# EAGLE design FTDI breakout-v1.0 (EAGLE 6.2)
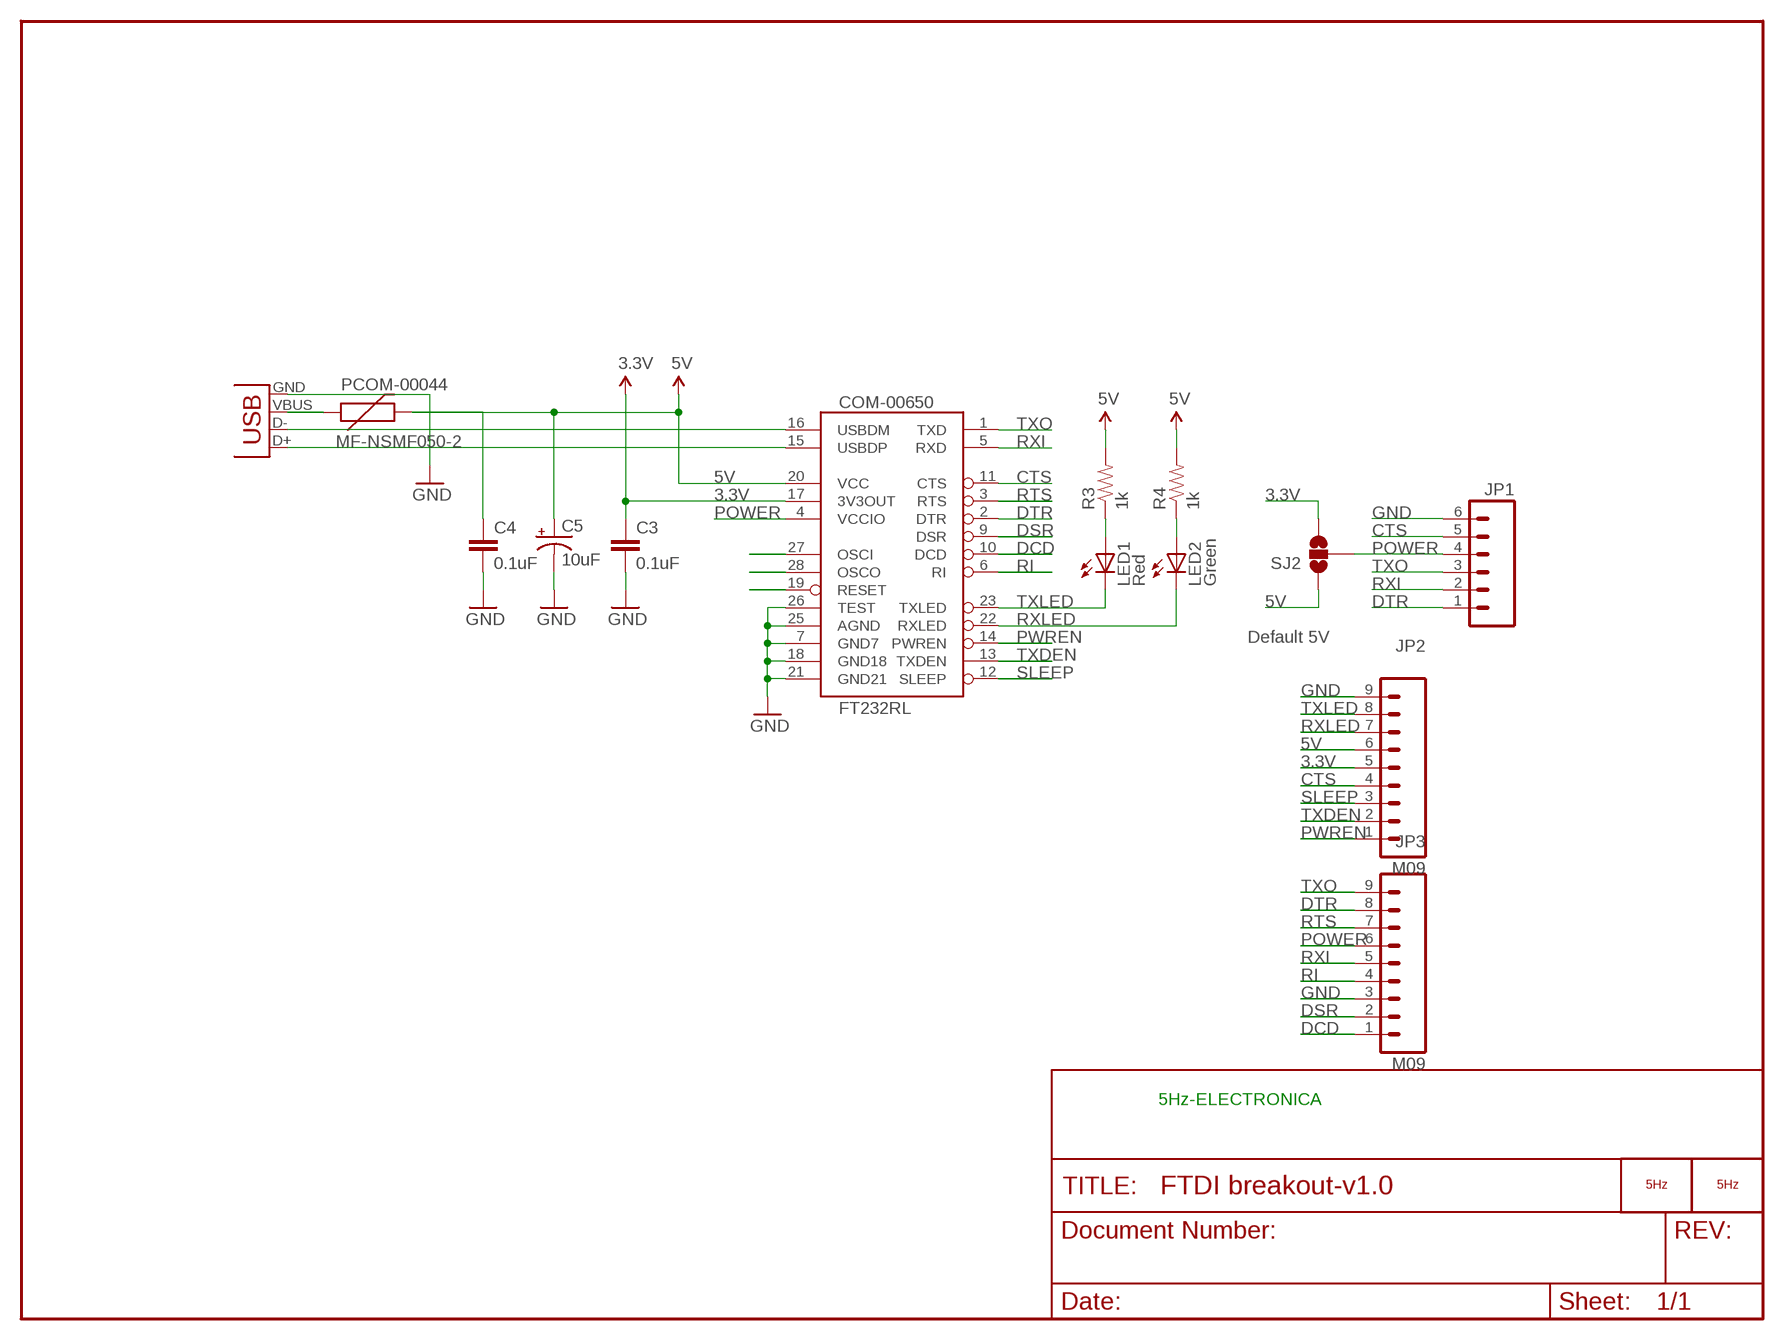
[diagram p0: schematic, sheet 1]

## Parts
C3  0.1uF  CAP0603-CAP  [0603-CAP]
C4  0.1uF  CAP0603-CAP  [0603-CAP]
C5  10uF  CAP_POL1206  [EIA3216]
COM-00650  FT232RL  FT232RLSSOP  [SSOP28DB]
JP1  M06SIP  [1X06]
JP2  M09  [1X09]
JP3  M09  [1X09]
LED1  Red  LED0603  [LED-0603]
LED2  Green  LED0603  [LED-0603]
LOGO1  LOGO_5HZ_H_5MM  [5HZ_LOGO_H_5MM]
LOGO2  LOGO_5HZ_H_15MM  [5HZ_LOGO_H_15MM]
PCOM-00044  MF-NSMF050-2  PTCSMD  [PTC-1206]
PRT-00587  897-43-005-00-100001  USBSMD  [USB-MINIB]
R3  1k  RESISTOR0603-RES  [0603-RES]
R4  1k  RESISTOR0603-RES  [0603-RES]
SJ2  SOLDERJUMPER_2WAYS  [SJ_3]

## Nets
3.3V [power]: C3.1 COM-00650.17(3V3OUT) JP2.5 SJ2.3
5V: C4.1 C5.A(+) COM-00650.20(VCC) JP2.6 PCOM-00044.2 R3.2 R4.2 SJ2.1
CTS: COM-00650.11(CTS) JP1.5 JP2.4
DCD: COM-00650.10(DCD) JP3.1
DSR: COM-00650.9(DSR) JP3.2
DTR: COM-00650.2(DTR) JP1.1 JP3.8
GND [power]: C3.2 C4.2 C5.C(-) COM-00650.7(GND7) COM-00650.18(GND18) COM-00650.21(GND21) COM-00650.25(AGND) COM-00650.26(TEST) JP1.6 JP2.9 JP3.3 PRT-00587.GND
N$1: LED1.A R3.1
N$2: LED2.A R4.1
N$3: PCOM-00044.1 PRT-00587.VBUS
N$11: COM-00650.19(RESET)
N$12: COM-00650.28(OSCO)
N$13: COM-00650.27(OSCI)
POWER: COM-00650.4(VCCIO) JP1.4 JP3.6 SJ2.2
PWREN: COM-00650.14(PWREN) JP2.1
RI [power]: COM-00650.6(RI) JP3.4
RTS: COM-00650.3(RTS) JP3.7
RXI: COM-00650.5(RXD) JP1.2 JP3.5
RXLED: COM-00650.22(RXLED) JP2.7 LED2.C
SLEEP: COM-00650.12(SLEEP) JP2.3
TXDEN: COM-00650.13(TXDEN) JP2.2
TXLED: COM-00650.23(TXLED) JP2.8 LED1.C
TXO: COM-00650.1(TXD) JP1.3 JP3.9
USB_D+: COM-00650.15(USBDP) PRT-00587.D+
USB_D-: COM-00650.16(USBDM) PRT-00587.D-

## Notes on the sheet
- Default 5V
- 5Hz-ELECTRONICA

## Library data of the parts
C3 C4 = SparkFun:CAP: Capacitor Standard 0603 ceramic capacitor, and 0.1" leaded capacitor.
C5 = SparkFun:CAP_POL: Capacitor Polarized These are standard SMD and PTH capacitors. Normally 10uF, 47uF, and 100uF in electrolytic and tantalum varieties. Always verify the external diameter of the through hole cap, it varies with capacity, voltage, and manufacturer. The EIA devices should be standard.
COM-00650 = SparkFun:FT232RL: USB UART FT232RL 4th Generation USB UART (USB <-> Serial) Controller. Spark Fun Electronics SKU : COM-00650
JP1 = SparkFun:M06: Header 6 Standard 6-pin 0.1" header. Use with straight break away headers (SKU : PRT-00116), right angle break away headers (PRT-00553), swiss pins (PRT-00743), machine pins (PRT-00117), and female headers (PRT-00115). Molex polarized connector foot print use with SKU : PRT-08094 with associated crimp pins and housings. NOTES ON THE VARIANTS LOCK and LOCK_LONGPADS... This footprint was designed to help hold the alignment of a through-hole component (i.e. 6-pin header) while soldering it into place. You may notice that each hole has been shifted either up or down by 0.005 of an inch from it's more standard position (which is a perfectly straight line). This slight alteration caused the pins (the squares in the middle) to touch the edges of the holes. Because they are alternating, it causes a "brace" to hold the component in place. 0.005 has proven to be the perfect amount of "off-center" position when using our standard breakaway headers. Although looks a little odd when you look at the bare footprint, once you have a header in there, the alteration is very hard to notice. Also, if you push a header all the way into place, it is covered up entirely on the bottom side. This idea of altering the position of holes to aid alignment will be further integrated into the Sparkfun Library for other footprints. It can help hold any component with 3 or more connection pins.
JP2 JP3 = SparkFun:M09: Header 9 Standard 9-pin 0.1" header. Use with straight break away headers (SKU : PRT-00116), right angle break away headers (PRT-00553), swiss pins (PRT-00743), machine pins (PRT-00117), and female headers (PRT-00115).
LED1 LED2 = SparkFun:LED: LEDs Standard schematic elements and footprints for 5mm, 3mm, 1206, and 0603 sized LEDs. 5mm - Spark Fun Electronics SKU : COM-00529 (and others)
LOGO1 LOGO2 = 5hz-electronica:LOGO_5HZ: Logotipo 5Hz "según Pedro"
PCOM-00044 = SparkFun:PTC: Resettable Fuse PTC Resettable Fuse. Spark Fun Electronics SKU : COM-08357
PRT-00587 = SparkFun:USB: USB Connectors USB-B-PTH is fully proven SKU : PRT-00139 USB-miniB is fully proven SKU : PRT-00587 USB-A-PCB is untested. USB-A-H is throughly reviewed, but untested. Spark Fun Electronics SKU : PRT-00437 USB-B-SMT is throughly reviewed, but untested. Needs silkscreen touching up. USB-A-S has not been used/tested USB-MB-H has not been used/tested
R3 R4 = SparkFun:RESISTOR: Resistor Basic schematic elements and footprints for 0603, 1206, and PTH resistors.
SJ2 = SparkFun:SOLDERJUMPER_2WAY: Solder Jumper 2 way solder jumper

## Net classes
0 default: width 0.203 mm
1 power: width 0.254 mm

## Board
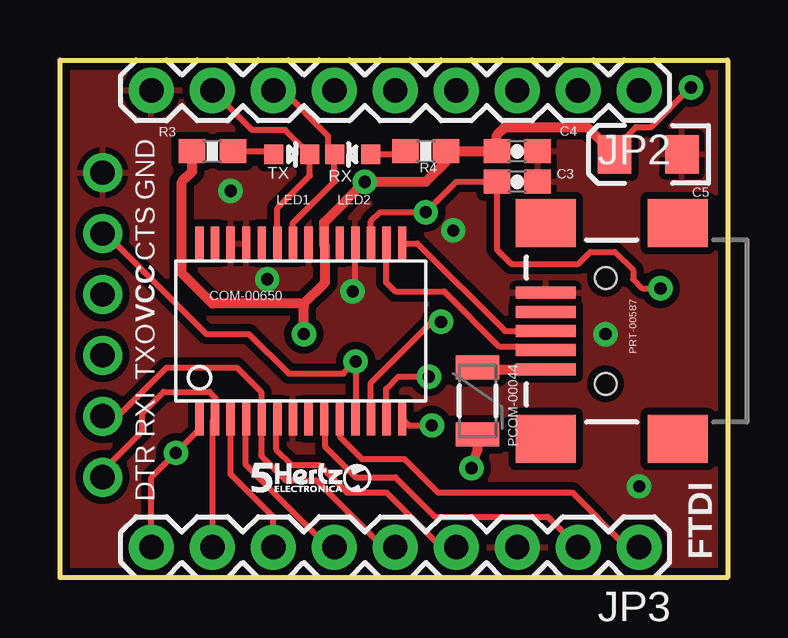
[diagram p1: board, top side]
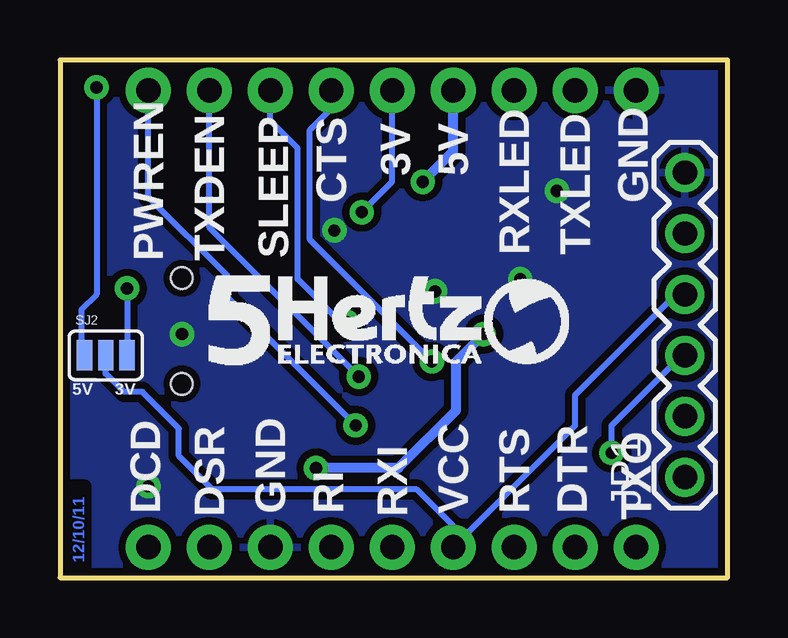
[diagram p2: board, bottom side, seen from below]

Size 27.81 x 21.59 mm. Coordinates in mm from the lower left corner, seen from the top.
Outline: 0,21.59 27.81,21.59 27.81,0 0,0 0,21.59
Copper layers (1*16): Top 0.035mm / dielectric 1.5mm / Bottom 0.035mm
Design rules: minimum track width 8mil, minimum drill 20mil, track to track 8mil, track to pad 8mil, pad to pad 8mil, via to via 8mil, smd to smd 8mil, copper to edge 10mil, drill to drill 8mil, minimum pad ring 12mil, minimum via ring 10mil, stop-mask expansion 4mil, vias tented up to drill 25mil, thermal gap 10mil

### Footprints (pad centres in the part's own frame; a part is rotated, then mirrored left to right if it is on the bottom)
0603-CAP = smd 1.1 x 1: 1 -0.85,0; 2 0.85,0
EIA3216 = smd 1.4 x 1.6: A 1.4,0; C -1.4,0
SSOP28DB = smd 0.348 x 1.397: 1 -4.225,-3.656; 2 -3.575,-3.656; 3 -2.925,-3.656; 4 -2.275,-3.656; 5 -1.625,-3.656; 6 -0.975,-3.656; 7 -0.325,-3.656; 8 0.325,-3.656; 9 0.975,-3.656; 10 1.625,-3.656; 11 2.275,-3.656; 12 2.925,-3.656; 13 3.575,-3.656; 14 4.225,-3.656; 15 4.225,3.656; 16 3.575,3.656; 17 2.925,3.656; 18 2.275,3.656; 19 1.625,3.656; 20 0.975,3.656; 21 0.325,3.656; 22 -0.325,3.656; 23 -0.975,3.656; 24 -1.625,3.656; 25 -2.275,3.656; 26 -2.925,3.656; 27 -3.575,3.656; 28 -4.225,3.656
1X06 = drill 1.016: 1 0,0; 2 2.54,0; 3 5.08,0; 4 7.62,0; 5 10.16,0; 6 12.7,0
1X09 = drill 1.016 pad 1.88: 1 0,0; 2 2.54,0; 3 5.08,0; 4 7.62,0; 5 10.16,0; 6 12.7,0; 7 15.24,0; 8 17.78,0; 9 20.32,0
LED-0603 = smd 0.8 x 0.8: A 0,-0.75; C 0,0.75
PTC-1206 = smd 1 x 1.8: 1 -1.4,0; 2 1.4,0
USB-MINIB = smd 2.5 x 0.5: D+ 2.5,0; D- 2.5,0.8; GND 2.5,-1.6; ID 2.5,-0.8; VBUS 2.5,1.6 | smd 2.5 x 2: GND@1 -3,-4.5; GND@2 -3,4.5; GND@3 2.5,4.5; GND@4 2.5,-4.5 | hole 0.9: 0,2.2; 0,-2.2
0603-RES = smd 1.1 x 1: 1 -0.85,0; 2 0.85,0
SJ_3 = smd 0.635 x 1.27: 1 -0.889,0; 2 0,0; 3 0.889,0

### Placement (x,y rotation side)
C3  19.05,16.51 0 top
C4  19.05,17.78 0 top
C5  24.51,17.65 180 top
COM-00650  10.03,10.29 0 top
JP1  1.78,4.19 90 bottom
JP2  24.13,20.32 180 top
JP3  24.13,1.27 180 top
LED1  9.65,17.65 270 top
LED2  12.19,17.65 90 top
LOGO1  8,3.56 0 top
LOGO2  21.59,8.89 0 bottom
PCOM-00044  17.4,7.37 270 top
PRT-00587  22.73,10.29 180 top
R3  6.35,17.78 180 top
R4  15.24,17.78 0 top
SJ2  25.91,9.27 0 bottom

### Tracks (layer width: path | path; a pad name or v marks a point on that pad's centre or on a via)
3.3V  (via drill 0.51)
  Top 0.254: COM-00650.17 12.96,14.86 13.34,15.24 v15.24,15.24 16.51,16.51 C3.1 18.2,13.68 18.8,13.08 21.59,13.08 22.1,13.59 23.11,13.59 23.88,12.83 23.88,12.45 24.26,12.06 v25.02,12.06
  Bottom 0.254: JP2.5 13.97,16.51 v15.24,15.24 | v25.02,12.06 SJ2.3
5V  (via drill 0.51)
  Top 0.254: 16.09,17.36 R4.2 | 10.03,11.43 10.16,11.43 | C5.A 23.11,17.9 24,18.8 24.64,18.8 v26.29,20.45
  Top 0.305: 11.01,13.88 COM-00650.20
  Top 0.406: 11.01,13.88 11.05,13.84 11.05,12.32 10.16,11.43 | 16.09,17.36 15.24,16.51 v12.7,16.51 11.01,14.82 COM-00650.20 | R3.2 5.5,16.93 5.08,16.51 5.08,12.7 6.35,11.43 10.03,11.43 10.16,11.3 v10.16,10.16 | C5.A 21.97,18.8 18.54,18.8 18.2,18.45 C4.1 R4.2 | PCOM-00044.2 17.4,5.33 v17.14,4.57
  Bottom 0.254: v26.29,20.45 26.29,11.81 26.92,11.18 26.92,9.4 SJ2.1
  Bottom 0.406: JP2.6 11.43,17.78 v12.7,16.51 | v17.14,4.57 13.72,4.57 11.3,6.99 11.3,9.02 v10.16,10.16
CTS  (via drill 0.51)
  Top 0.254: COM-00650.11 12.32,6.64 v12.32,9.02 11.81,8.51 9.53,8.51 7.87,10.16 6.1,10.16 1.91,14.35 JP1.5
  Bottom 0.254: JP2.4 16.51,19.56 17.4,18.67 17.4,14.1 v12.32,9.02
DCD
  Top 0.254: JP3.1 23.62,1.27 21.34,3.56 15.75,3.56 14.35,4.95 12.57,4.95 11.68,5.84 11.68,6.61 COM-00650.10
DSR
  Top 0.254: JP3.2 20.32,2.54 15.62,2.54 13.97,4.19 12.32,4.19 11.05,5.46 11.05,6.59 COM-00650.9
DTR
  Top 0.254: JP1.1 1.78,4.45 3.43,6.1 3.43,6.86 4.32,7.75 6.22,7.75 6.48,7.49 6.48,6.6 COM-00650.2 6.35,6.52 JP3.8
GND  (via drill 0.51)
  Top 0.254: 12.31,12.05 COM-00650.18
  other vias: 7.11,16.13 24.13,3.81 8.64,12.45 12.19,11.94 22.73,10.16 16.38,14.48
  pour Top (isolate 0.305): 0,21.59 27.81,21.59 27.81,0 0.13,0
  pour Bottom (isolate 0.305): 0,21.59 27.81,21.59 27.81,0 24.51,0 3.17,0.13 -0.13,0.13
N$1
  Top 0.254: R3.1 8.78,17.78 LED1.A
N$2
  Top 0.254: LED2.A 14.26,17.65 R4.1
N$3
  Top 0.254: PCOM-00044.1 17.61,8.69
  Top 0.406: 17.61,8.69 PRT-00587.VBUS
POWER
  Top 0.254: JP3.6 11.18,1.27 7.75,4.7 7.75,6.62 COM-00650.4
  Bottom 0.254: JP1.4 2.16,11.81 6.35,7.62 6.35,6.35 JP3.6 11.43,2.16 12.95,3.68 21.46,3.68 22.86,5.08 22.86,6.22 24.38,7.75 25.15,7.75 25.91,8.51 SJ2.2
PWREN  (via drill 0.51)
  Top 0.254: v15.49,6.35 14.54,6.35 COM-00650.14
  Bottom 0.254: JP2.1 24.13,15.88 20.83,12.57 20.83,11.68 v15.49,6.35
RI
  Top 0.254: JP3.4 15.88,1.27 13.59,3.56 11.94,3.56 10.79,4.7 9.65,4.7 9.02,5.33 9.02,6.59 COM-00650.6
RTS
  Top 0.254: JP3.7 8.89,2.54 7.11,4.32 COM-00650.3
RXI
  Top 0.254: JP1.2 2.41,6.73 4.45,8.76 7.37,8.76 8.38,7.75 8.38,6.66 COM-00650.5 | 8.38,6.6 COM-00650.5 | JP3.5 13.46,1.27 10.67,4.06 9.4,4.06 8.38,5.08 8.38,6.61 COM-00650.5
RXLED
  Top 0.254: COM-00650.22 9.71,14.79 11.43,16.51 LED2.C 11.18,17.92 11.18,18.41 9.27,20.32 JP2.7
SLEEP  (via drill 0.51)
  Top 0.254: v15.88,10.67 15.49,10.67 12.95,8.13 COM-00650.12
  Bottom 0.254: JP2.3 19.05,19.05 17.91,17.91 17.91,12.45 16.13,10.67 v15.88,10.67
TXDEN  (via drill 0.51)
  Top 0.254: v15.37,8.38 14.1,8.38 13.59,7.87 13.59,6.65 COM-00650.13
  Bottom 0.254: JP2.2 21.59,14.61 v15.37,8.38
TXLED
  Top 0.254: COM-00650.23 9.06,15.41 10.41,16.76 10.41,17.64 LED1.C 9.39,18.67 8,18.67 JP2.8
TXO  (via drill 0.51)
  Top 0.254: COM-00650.1 5.81,6.19 v4.83,5.21 3.81,4.19 JP3.9
  Bottom 0.254: v4.83,5.21 4.83,6.35 1.91,9.27
  Bottom 0.305: 1.91,9.27 JP1.3
USB_D+
  Top 0.254: COM-00650.15 14.89,13.94 18.54,10.29 PRT-00587.D+
USB_D-
  Top 0.254: COM-00650.16 13.61,13.86 13.59,13.84 13.59,12.32 13.97,11.94 16,11.94 18.29,9.65 19.05,9.65 19.18,9.53 20.2,9.53 | 20.14,9.4 PRT-00587.D- 20.2,9.53 | 20.2,9.53 20.32,9.53

### Text on the board
Bottom: 12/10/11
tPlace: TX | RX | GND | CTS | VCC | TXO | RXI | DTR | FTDI
bPlace: 5V | 3V | GND | CTS | TXLED | RXLED | SLEEP | TXDEN | PWREN | 3V | 5V | DTR | RTS | VCC | RXI | RI | GND | DSR | DCD | TXO
tValues: Close